# Altium schematic sheet 5V Buck Converter.SchDoc
size A4; SheetNumber: 2; SheetTotal: 5
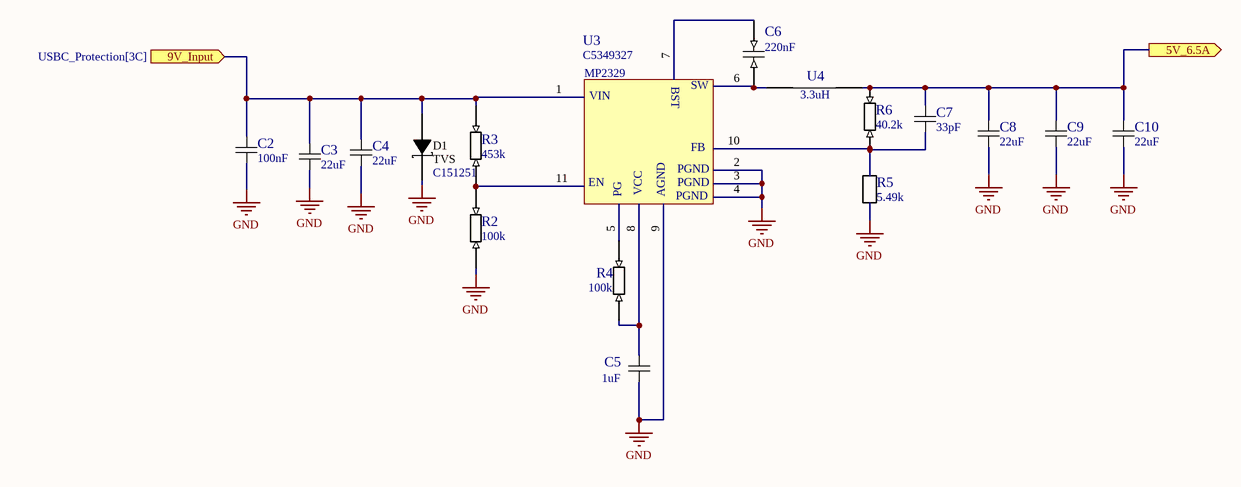
[diagram p0: 5V Buck Converter.SchDoc]

## Parts
C2  value 100nF  [C0603]  (hidden comment: C0603X7R104K250NT)
C3  value 22uF  [C0805]  (hidden comment: CL21A226MAQNNNE)
C4  value 22uF  [C0805]  (hidden comment: CL21A226MAQNNNE)
C5  value 1uF  [C0603]  (hidden comment: CL10A105KB8NNNC)
C6  value 220nF  [C0603]  (hidden comment: CL10B224KA8NNNC)
C7  value 33pF  [C0603]  (hidden comment: TCC0603COG330F500CT)
C8  value 22uF  [C0805]  (hidden comment: CL21A226MAQNNNE)
C9  value 22uF  [C0805]  (hidden comment: CL21A226MAQNNNE)
C10  value 22uF  [C0805]  (hidden comment: CL21A226MAQNNNE)
D1  TVS  Name: C151251  [SMB_L4.6-W3.6-LS5.3-RD]
R2  value 100k  [R0603]  (hidden comment: 0603WAF1003T5E)
R3  value 453k  [R0603]  (hidden comment: 0603WAF4533T5E)
R4  value 100k  [R0603]  (hidden comment: 0603WAF1003T5E)
R5  value 5.49k  [R0603]  (hidden comment: FRQ0603F5491TS)
R6  value 40.2k  [R0603]  (hidden comment: 0603WAF4022T5E)
U3  Name: C5349327  [QFN-11_L2.0-W2.0-P0.50_MP2384CGG-Z]  (hidden comment: MP2329GG-Z)
U4  value 3.3uH  [IND-SMD_L9.2-W8.0]  (hidden comment: CYA0850-3.3UH)

## Ports
5V_6.5A (out), 9V_Input (in, see USBC_Protection[3C])

## Nets
GND: C2.1 C3.1 C4.1 C5.1 C8.2 C9.2 C10.2 D1.1(K) R2.1 R5.1 U3.2 U3.3 U3.4 U3.9
5V_6.5A: C7.2 C8.1 C9.1 C10.1 R6.2 U4.2 ; port 5V_6.5A
9V_Input: C2.2 C3.2 C4.2 D1.2(A) R3.2 U3.1 ; port 9V_Input
NetC5_2: C5.2 R4.1 U3.8
NetC6_1: C6.1 U3.6 U4.1
NetC6_2: C6.2 U3.7
NetC7_1: C7.1 R5.2 R6.1 U3.10
NetR2_2: R2.2 R3.1 U3.11
NetR4_2: R4.2 U3.5

## Notes on the sheet
- (in symbol MP2329GG-Z) MP2329; BST; SW; VIN; FB; PGND; EN; VCC; PG; AGND

## Library data of the parts
C2 = C0603X7R104K250NT: Name: C466768; Source: LCSC
C3 C4 C8-C10 = CL21A226MAQNNNE: 22uF ±20% 25V Ceramic Capacitor X5R 0805; Name: C45783; Source: LCSC
C5 = CL10A105KB8NNNC: 1uF ±10% 50V Ceramic Capacitor X5R 0603; Name: C15849; Source: LCSC
C6 = CL10B224KA8NNNC: 220nF ±10% 25V Ceramic Capacitor X7R 0603; Name: C21120; Source: LCSC
C7 = TCC0603COG330F500CT: 33pF C0G ±1% 50V 0603 Ceramic Capacitors; Name: C48543706; Source: LCSC
D1 = SMBJ12A_C151251: 21.5VC Clamp 28A@10/1000us Ipp TVS DIODE DO-214AA; Source: LCSC
R2 R4 = 0603WAF1003T5E: 100kÎ© Â±1% 100mW 0603 Thick Film Resistor; Name: C25803; Source: LCSC
R3 = 0603WAF4533T5E: 453kÎ© Â±1% 100mW 0603 Thick Film Resistor; Name: C25818; Source: LCSC
R5 = FRQ0603F5491TS: 5.49kÎ© 100mW 75V Thick Film Resistor Â±100ppm/â„ƒ Â±1% 0603 Chip Resistor - Surface Mount; Name: C54102278; Source: LCSC
R6 = 0603WAF4022T5E: 40.2kÎ© Â±1% 100mW 0603 Thick Film Resistor; Name: C12447; Source: LCSC
U4 = CYA0850-3.3UH: 10A 3.3uH ±20% 15A Molded inductor SMD,9.2x8mm Fixed Inductors; Name: C19268642; Source: LCSC
U3 = MP2329GG-Z: Source: LCSC